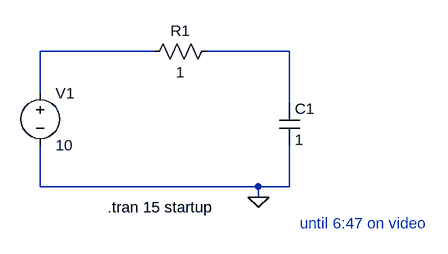
[diagram p0: schematic part1.asc]
part1.asc, the LTspice schematic file:
Version 4
SHEET 1 880 680
WIRE 144 192 -32 192
WIRE 352 192 224 192
WIRE -32 256 -32 192
WIRE 352 272 352 192
WIRE -32 400 -32 336
WIRE 304 400 -32 400
WIRE 352 400 352 336
WIRE 352 400 304 400
WIRE 304 416 304 400
FLAG 304 416 0
SYMBOL voltage -32 240 R0
SYMATTR InstName V1
SYMATTR Value 10
SYMATTR SpiceLine Rser=0
SYMBOL res 240 176 R90
WINDOW 0 0 56 VBottom 2
WINDOW 3 32 56 VTop 2
SYMATTR InstName R1
SYMATTR Value 1
SYMBOL cap 336 272 R0
SYMATTR InstName C1
SYMATTR Value 1
TEXT 72 432 Left 2 !.tran 15 startup
TEXT 368 456 Left 2 ;until 6:47 on video

The netlist it stands for:
* part1.asc
V1 N001 0 10 Rser=0
R1 N002 N001 1
C1 N002 0 1
.tran 15 startup
* until 6:47 on video
.backanno
.end